# EAGLE design prog_adapter (EAGLE 6.4)
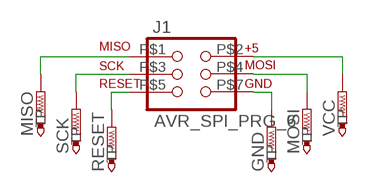
[diagram p0: schematic, sheet 1]

## Parts
GND  PTR1PAD1-17  [P1-17]
J1  AVR_SPI_PRG_6  [2X3_ICSP_SMD]
MISO  PTR1PAD1-17  [P1-17]
MOSI  PTR1PAD1-17  [P1-17]
RESET  PTR1PAD1-17  [P1-17]
SCK  PTR1PAD1-17  [P1-17]
VCC  PTR1PAD1-17  [P1-17]

## Nets
N$1: J1.P$1 MISO.TP
N$2: J1.P$3 SCK.TP
N$3: J1.P$5 RESET.TP
N$4: J1.P$2 VCC.TP
N$5: J1.P$4 MOSI.TP
N$6: GND.TP J1.P$7

## Library data of the parts
GND MISO MOSI RESET SCK VCC = testpad:PTR1: TEST PIN
J1 = SparkFun:AVR_SPI_PRG_6: AVR ISP 6 Pin This is the reduced ISP connector for AVR programming. Common on Arduino. This footprint will take up less PCB space and can be used with a 10-pin to 6-pin adapter such as SKU: BOB-08508

## Board
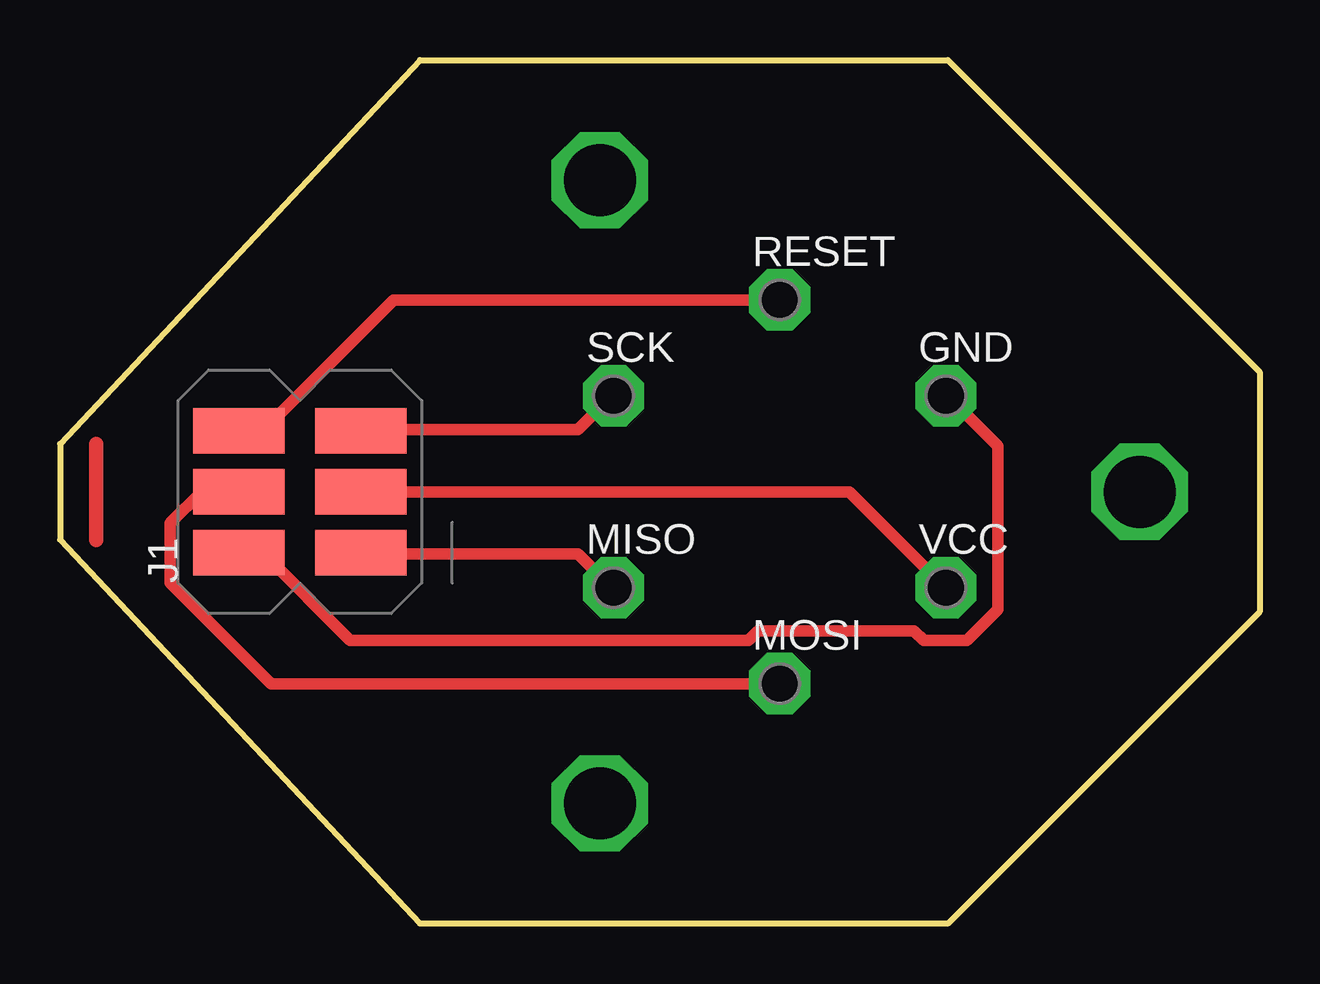
[diagram p1: board, top side]

Size 50 x 36 mm. Coordinates in mm from the lower left corner, seen from the top.
Outline: 0,20 15,36 37,36 50,23 50,13 37,0 15,0 0,16 0,20
Copper layers (1*16): Top 0.035mm / dielectric 1.5mm / Bottom 0.035mm
Design rules "default *": minimum track width 19mil, minimum drill 24mil, track to track 0.7mm, track to pad 0.7mm, pad to pad 0.7mm, via to via 0.7mm, smd to smd 0.7mm, copper to edge 40mil, drill to drill 25mil, minimum pad ring 10mil, minimum via ring 8mil, stop-mask expansion 4mil, vias tented up to drill 0mil, thermal gap 10mil

### Footprints (pad centres in the part's own frame; a part is rotated, then mirrored left to right if it is on the bottom)
P1-17 = drill 1.702 pad 2.54 octagon: TP 0,0
2X3_ICSP_SMD = smd 1.905 x 3.81: P$1 -2.54,-2.54; P$2 0,-2.54; P$3 2.54,-2.54; P$4 0,2.54; P$5 2.54,2.54; P$7 -2.54,2.54

### Placement (x,y rotation side)
GND  36.93,22 0 top
J1  10,18 90 top
MISO  23.07,14 0 top
MOSI  30,10 0 top
RESET  30,26 0 top
SCK  23.07,22 0 top
VCC  36.93,14 0 top

### Tracks (layer width: path | path; a pad name or v marks a point on that pad's centre or on a via)
N$1
  Top 0.483: J1.P$1 12.6,15.4 21.6,15.4 23,14 MISO.TP
N$2
  Top 0.483: J1.P$3 12.6,20.6 21.6,20.6 23,22 SCK.TP
N$3
  Top 0.483: RESET.TP 13.9,26 8.5,20.6 7.5,20.6 J1.P$5
N$4
  Top 0.483: J1.P$2 32.9,18 36.9,14 VCC.TP
N$5
  Top 0.483: J1.P$4 5.9,18 4.6,16.7 4.6,14.2 8.8,10 MOSI.TP
N$6
  Top 0.483: J1.P$7 7.5,15.4 8.5,15.4 12.1,11.8 28.7,11.8 29.1,12.2 35.6,12.2 36,11.8 37.8,11.8 39.1,13.1 39.1,19.9 37,22 GND.TP
N$7  (via drill 3)
  other vias: 45,18
N$8  (via drill 3)
  other vias: 22.5,30.99
N$9  (via drill 3)
  other vias: 22.5,5.01
N$12
  Top 0.61: 1.5,20 1.5,16